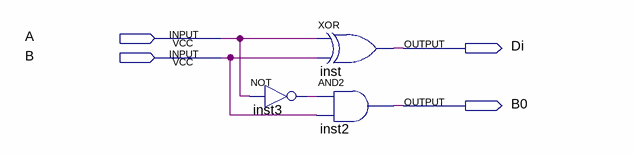
[diagram p0: schematic sheet]
// Quartus schematic semi_minus.bdf as structural Verilog: 3 symbols, 4 pins
module semi_minus (
  input  A,
  input  B,
  output Di,
  output B0
);

  wire inst3_out;

  not inst3 (inst3_out, A);
  xor inst (Di, A, B);
  and inst2 (B0, inst3_out, B);
endmodule
